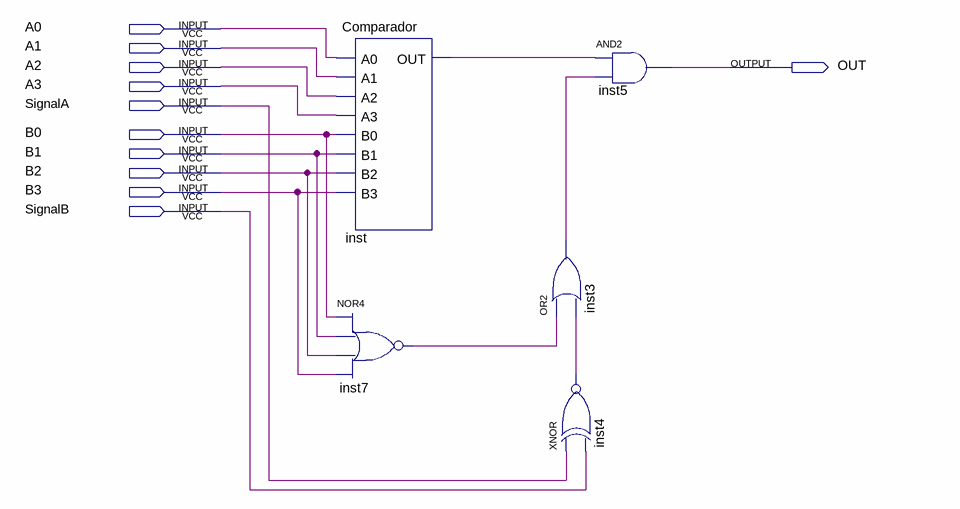
[diagram p0: schematic sheet]
// Quartus schematic FullComparador.bdf as structural Verilog: 5 symbols, 11 pins
module FullComparador (
  input  A0,
  input  A1,
  input  A2,
  input  A3,
  input  SignalA,
  input  B0,
  input  B1,
  input  B2,
  input  B3,
  input  SignalB,
  output OUT
);

  wire inst3_out, inst4_out, inst7_out, inst_out;

  Comparador inst (.A0(A0), .A1(A1), .A2(A2), .A3(A3), .B0(B0), .B1(B1), .B2(B2), .B3(B3), .OUT(inst_out));
  nor inst7 (inst7_out, B0, B1, B2, B3);
  or inst3 (inst3_out, inst7_out, inst4_out);
  and inst5 (OUT, inst_out, inst3_out);
  xnor inst4 (inst4_out, SignalA, SignalB);
endmodule
